# EAGLE design ledfaderV2 (EAGLE 6.5.0)
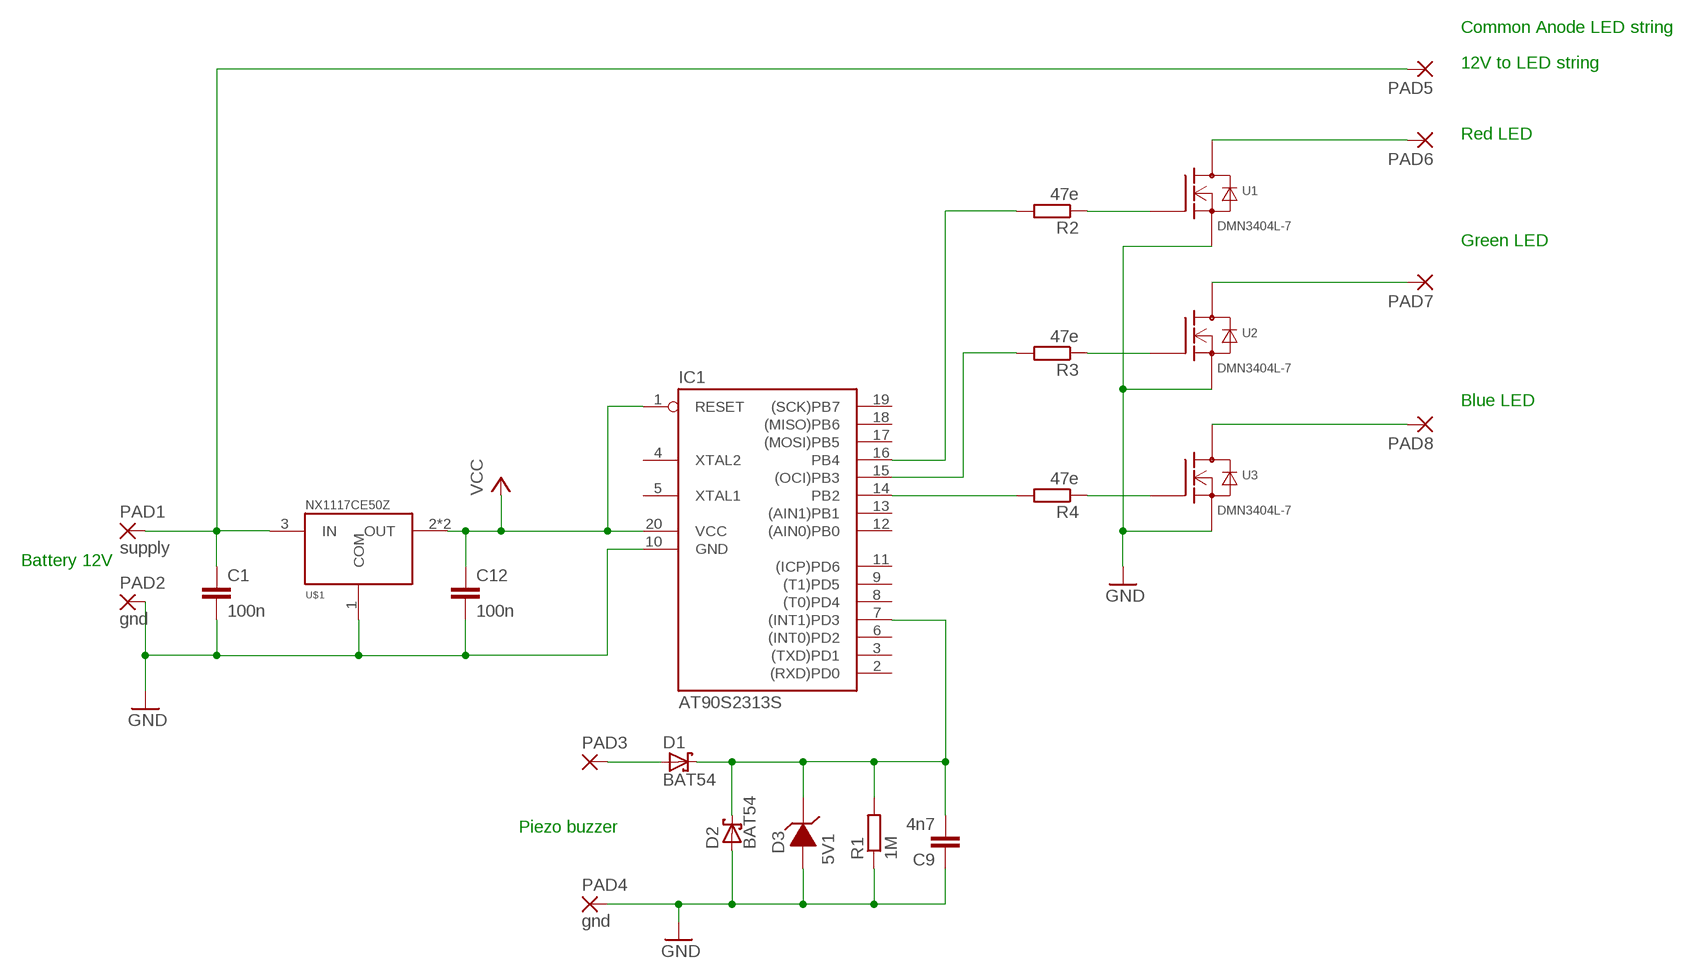
[diagram p0: schematic, sheet 1]

## Parts
C1  100n  C-EUC1206  [C1206]
C9  4n7  C-EUC1206  [C1206]
C12  100n  C-EUC1206  [C1206]
D1  BAT54  [SOT23]
D2  BAT54  [SOT23]
D3  5V1  D_ZENERE  [MINI-MELF]
IC1  AT90S2313S  [SO20L]
PAD1  supply  SMD5  [SMD2,54-5,08]
PAD2  gnd  SMD5  [SMD2,54-5,08]
PAD3  SMD5  [SMD2,54-5,08]
PAD4  gnd  SMD5  [SMD2,54-5,08]
PAD5  SMD5  [SMD2,54-5,08]
PAD6  SMD5  [SMD2,54-5,08]
PAD7  SMD5  [SMD2,54-5,08]
PAD8  SMD5  [SMD2,54-5,08]
R1  1M  R-EU_M1206  [M1206]
R2  47e  R-EU_M1206  [M1206]
R3  47e  R-EU_M1206  [M1206]
R4  47e  R-EU_M1206  [M1206]
U1  DMN3404L-7  [SOT95P235X112-3N]
U2  DMN3404L-7  [SOT95P235X112-3N]
U3  DMN3404L-7  [SOT95P235X112-3N]
U$1  NX1117CE50Z  [SOT223]

## Nets
GND: C9.1 D2.1(A) D3.1(A) PAD4.1(P) R1.1 U1.2(S) U2.2(S) U3.2(S)
N$1: C1.1 PAD1.1(P) PAD5.1(P) U$1.3(IN)
N$2: C9.2 D1.3(C) D2.3(C) D3.2(C) IC1.7((INT1)PD3) R1.2
N$3: PAD6.1(P) U1.3(D)
N$4: PAD7.1(P) U2.3(D)
N$5: D1.1(A) PAD3.1(P)
N$6: PAD8.1(P) U3.3(D)
N$7: R2.1 U1.1(G)
N$8: C1.2 C12.2 IC1.10(GND) PAD2.1(P) U$1.1(COM) ; supply symbol labelled GND
N$9: R3.1 U2.1(G)
N$10: IC1.16(PB4) R2.2
N$11: IC1.15((OCI)PB3) R3.2
N$12: IC1.14(PB2) R4.2
N$13: R4.1 U3.1(G)
VCC: C12.1 IC1.1(RESET) IC1.20(VCC) U$1.2(OUT) U$1.4(OUT)
Unconnected: IC1.2((RXD)PD0) IC1.3((TXD)PD1) IC1.4(XTAL2) IC1.5(XTAL1) IC1.6((INT0)PD2) IC1.8((T0)PD4) IC1.9((T1)PD5) IC1.11((ICP)PD6) IC1.12((AIN0)PB0) IC1.13((AIN1)PB1) IC1.17((MOSI)PB5) IC1.18((MISO)PB6) IC1.19((SCK)PB7)

## Notes on the sheet
- Common Anode LED string
- 12V to LED string
- Red LED
- Green LED
- Blue LED
- Battery 12V
- Piezo buzzer

## Library data of the parts
C1 C9 C12 = rcl:C-EU: CAPACITOR, European symbol
D1 D2 = diode:BAT54: Schottky Diodes Source: Fairchild .. BAT54.pdf
D3 = m-pad-2.1:D_ZENER: Zener diodes in various packages
IC1 = atmel:AT90S2313: MICROCONTROLLER 2 Kbytes FLASH 128 bytes SRAM 128 bytes EEPROM UART; OC_FARNELL: unknown; OC_NEWARK: unknown
PAD1-PAD8 = wirepad:SMD5: SMD PAD
R1-R4 = resistor_3rdPin_v20:R-EU_: RESISTOR, European symbol
U1-U3 = Wilfred:DMN3404L-7: N-CHANNEL ENHANCEMENT MODE MOSFET; MPN: DMN3404L-7; OC_FARNELL: 1858601; OC_NEWARK: 23T5605; PACKAGE: SOT-23-3; SUPPLIER: Diodes Inc
U$1 = Wilfred:NX1117CE50Z: 5V LDO Voltage regulator

## Board
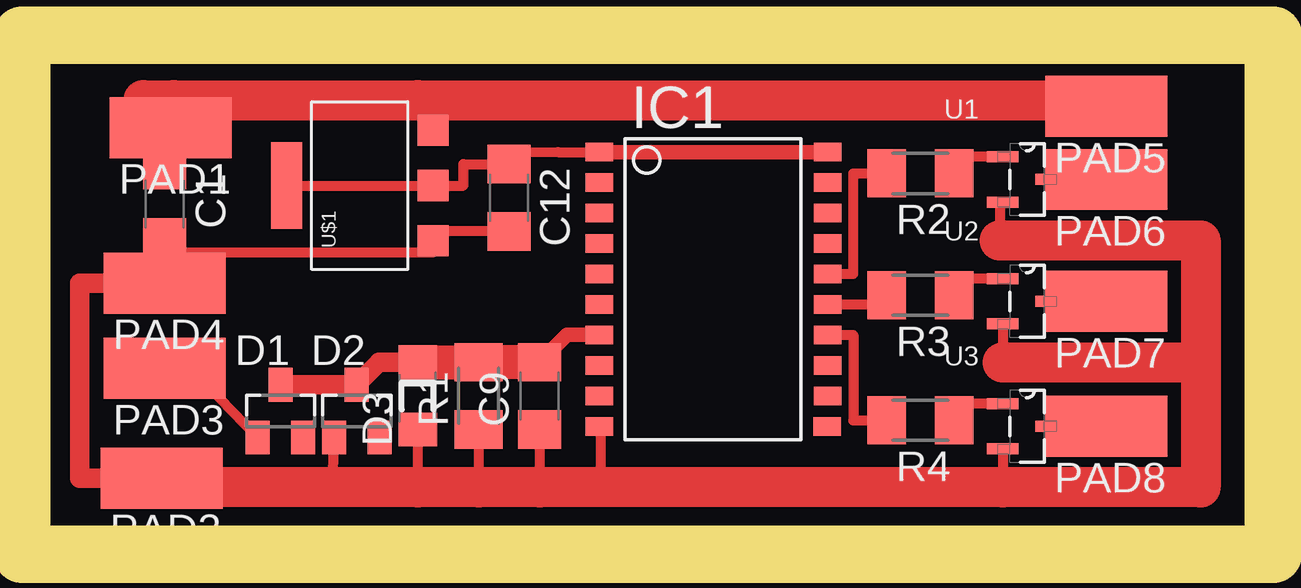
[diagram p1: board, top side]

No outline drawn. Coordinates in mm, seen from the top.
Copper layers (1*16): Top 0.035mm / dielectric 1.5mm / Bottom 0.035mm
Design rules "default": minimum track width 10mil, minimum drill 24mil, track to track 8mil, track to pad 8mil, pad to pad 8mil, via to via 8mil, smd to smd 8mil, copper to edge 40mil, drill to drill 8mil, minimum pad ring 10mil, minimum via ring 8mil, stop-mask expansion 4mil, vias tented up to drill 0mil, thermal gap 10mil
Milling: 4 lines

### Footprints (pad centres in the part's own frame; a part is rotated, then mirrored left to right if it is on the bottom)
C1206 = smd 1.6 x 1.8: 1 -1.4,0; 2 1.4,0
SOT23 = smd 1 x 1.4: 1 -0.95,-1.1; 2 0.95,-1.1; 3 0,1.1
MINI-MELF = smd 1.4 x 1.6: 1 -1.4,0; 2 1.4,0
SO20L = smd 0.762 x 1.143: 1 -5.08,-5.131; 2 -3.81,-5.131; 3 -2.54,-5.131; 4 -1.27,-5.131; 5 0,-5.131; 6 1.27,-5.131; 7 2.54,-5.131; 8 3.81,-5.131; 9 5.08,-5.131; 10 6.35,-5.131; 11 6.35,4.369; 12 5.08,4.394; 13 3.81,4.394; 14 2.54,4.394; 15 1.27,4.394; 16 0,4.394; 17 -1.27,4.394; 18 -2.54,4.394; 19 -3.81,4.394; 20 -5.08,4.394
SMD2,54-5,08 = smd 2.54 x 5.08: 1 0,0
M1206 = smd 1.6 x 2: 1 -1.4,0; 2 1.4,0
SOT95P235X112-3N = smd 1.321 x 0.457: 1 -1.016,0.94; 2 -1.016,-0.94; 3 1.016,0
SOT223 = smd 1.3 x 1.3: 1 -2.3,-3.05; 2 0,-3.05; 3 2.3,-3.05 | smd 3.6 x 1.3: 4 0,3.05

### Placement (x,y rotation side)
C1  4.7,13.46 270 top
C9  20.32,5.46 90 top
C12  19.05,13.72 270 top
D1  9.53,4.83 0 top
D2  12.7,4.83 0 top
D3  15.24,5.46 90 top
IC1  27.94,10.54 270 top
PAD1  4.95,16.64 90 top
PAD2  4.57,2.03 90 top
PAD3  4.7,6.6 90 top
PAD4  4.7,10.16 90 top
PAD5  43.94,17.53 90 top
PAD6  43.94,14.48 90 top
PAD7  43.94,9.4 90 top
PAD8  43.94,4.19 90 top
R1  17.78,5.46 90 top
R2  36.2,14.73 180 top
R3  36.2,9.65 180 top
R4  36.2,4.45 180 top
U1  40.64,14.48 0 top
U2  40.64,9.4 0 top
U3  40.64,4.19 0 top
U$1  12.83,14.22 90 top

### Tracks (layer width: path | path; a pad name or v marks a point on that pad's centre or on a via)
GND
  Top 0.2: U3.2 39.5,3.25
  Top 0.406: U3.2 39.62,1.65 | 1.27,10.03 4.7,10.03 PAD4.1 | C9.1 20.32,1.65 | R1.1 17.78,1.65 | D3.1 15.24,1.65 | D2.1 11.68,1.95 5.08,1.78 | 1.14,10.03 1.27,10.03 | 1.27,10.03 1.27,2.03 3.68,2.03 3.68,1.91 | U1.2 39.5,13.54 39.5,11.94 | U2.2 39.62,6.86
  Top 1.676: 5.08,1.65 15.24,1.65 17.78,1.65 20.32,1.65 39.62,1.65 47.88,1.65 47.88,6.86 | 5.08,1.65 5.08,1.78 4.32,2.03 5.08,1.65 | 5.08,1.65 4.32,2.29 5.46,1.91 3.68,1.91 | 39.5,11.94 47.88,11.94 47.88,6.86 | 39.62,6.86 47.88,6.86
N$1
  Top 0.254: PAD1.1 5.08,16.89 5.08,15.62 C1.1
  Top 0.406: C1.1 PAD1.1 4.7,17.14 5.08,17.78 | U$1.3 15.24,17.78
  Top 0.813: 44.45,17.78 PAD5.1
  Top 1.676: 3.81,17.78 5.08,17.78 15.24,17.78 44.45,17.78
N$2
  Top 0.61: IC1.7 21.46,8 C9.2
  Top 0.813: D3.2 13.63,6.86 D2.3 D1.3
  Top 1.422: D3.2 R1.2 C9.2
N$3
  Top 0.406: PAD6.1 U1.3
N$4
  Top 0.406: PAD7.1 U2.3
N$5
  Top 0.406: PAD3.1 4.7,5.84 6.48,5.88 D1.1
N$6
  Top 0.406: PAD8.1 U3.3
N$7
  Top 0.2: 37.59,15.42 R2.1
  Top 0.406: U1.1 37.59,15.42
N$8
  Top 0.406: C12.2 15.88,12.32 U$1.1 | 4.84,11.92 C1.2 4.7,11.43 | 15.88,11.43 4.7,11.43 | C12.2 15.88,12.32 15.88,11.43 | IC1.10 22.86,4.19 22.86,2.03 | 4.7,11.43 4.7,10.16 4.57,10.16 4.57,11.81 4.7,11.81 | C12.2 16,12.32 16,11.94 15.88,11.43 | 1.14,6.22 1.27,2.03 | PAD2.1 22.86,2.03 | 22.86,2.03 22.86,1.91
  Top 0.813: PAD2.1 1.27,2.03 1.14,2.03 1.14,6.22 1.14,10.16 4.57,10.16
N$9
  Top 0.2: 37.59,10.34 R3.1
  Top 0.406: U2.1 37.59,10.34
N$10
  Top 0.406: IC1.16 33.4,10.54 33.4,14.73 R2.2
N$11
  Top 0.2: 34.8,9.27 R3.2
  Top 0.406: IC1.15 34.8,9.27
N$12
  Top 0.406: IC1.14 33.4,8 33.4,4.45 R4.2
N$13
  Top 0.2: 37.59,5.13 R4.1
  Top 0.406: U3.1 37.59,5.13
VCC
  Top 0.406: U$1.4 U$1.2 17.14,14.22 17.14,15.11 19.56,15.11 C12.1 19.56,15.62 21.08,15.62 IC1.1
  Top 0.61: IC1.1 IC1.20